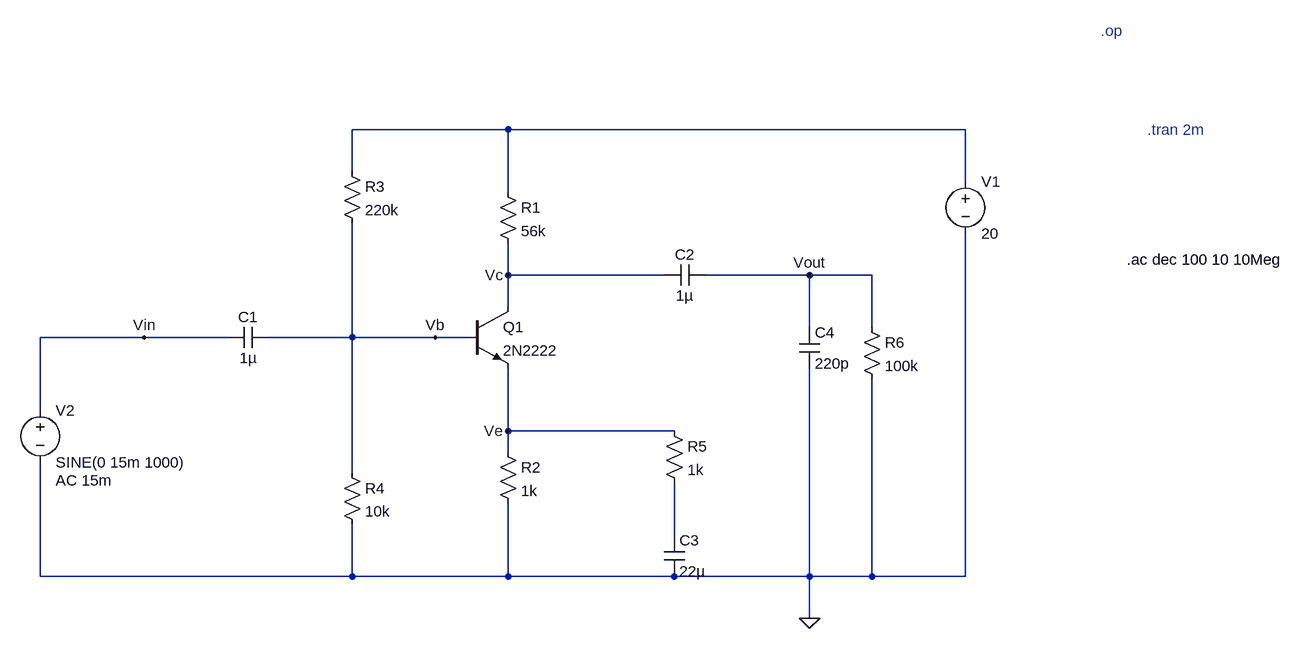
[diagram p0: schematic BJTCE.asc]
BJTCE.asc, the LTspice schematic file:
Version 4.1
SHEET 1 1384 680
WIRE 176 -192 -64 -192
WIRE 880 -192 176 -192
WIRE -64 -128 -64 -192
WIRE 880 -112 880 -192
WIRE 176 -96 176 -192
WIRE 176 32 176 -16
WIRE 416 32 176 32
WIRE 640 32 480 32
WIRE 736 32 640 32
WIRE 176 80 176 32
WIRE 640 112 640 32
WIRE 736 112 736 32
WIRE -384 128 -544 128
WIRE -256 128 -384 128
WIRE -64 128 -64 -48
WIRE -64 128 -192 128
WIRE 64 128 -64 128
WIRE 112 128 64 128
WIRE -544 240 -544 128
WIRE 176 272 176 176
WIRE 432 272 176 272
WIRE 176 304 176 272
WIRE -64 336 -64 128
WIRE 432 432 432 352
WIRE -544 496 -544 320
WIRE -64 496 -64 416
WIRE -64 496 -544 496
WIRE 176 496 176 384
WIRE 176 496 -64 496
WIRE 432 496 176 496
WIRE 640 496 640 176
WIRE 640 496 432 496
WIRE 736 496 736 192
WIRE 736 496 640 496
WIRE 880 496 880 -32
WIRE 880 496 736 496
WIRE 640 560 640 496
FLAG 640 560 0
FLAG 640 32 Vout
FLAG -384 128 Vin
FLAG 64 128 Vb
FLAG 176 32 Vc
FLAG 176 272 Ve
SYMBOL npn 112 80 R0
SYMATTR InstName Q1
SYMATTR Value 2N2222
SYMBOL res 160 -112 R0
SYMATTR InstName R1
SYMATTR Value 56k
SYMBOL res 160 288 R0
SYMATTR InstName R2
SYMATTR Value 1k
SYMBOL res -80 -144 R0
SYMATTR InstName R3
SYMATTR Value 220k
SYMBOL res -80 320 R0
SYMATTR InstName R4
SYMATTR Value 10k
SYMBOL res 416 256 R0
SYMATTR InstName R5
SYMATTR Value 1k
SYMBOL res 720 96 R0
SYMATTR InstName R6
SYMATTR Value 100k
SYMBOL cap -192 112 R90
WINDOW 0 0 32 VBottom 2
WINDOW 3 32 32 VTop 2
SYMATTR InstName C1
SYMATTR Value 1µ
SYMBOL cap 480 16 R90
WINDOW 0 0 32 VBottom 2
WINDOW 3 32 32 VTop 2
SYMATTR InstName C2
SYMATTR Value 1µ
SYMBOL cap 416 432 R0
SYMATTR InstName C3
SYMATTR Value 22µ
SYMBOL cap 624 112 R0
SYMATTR InstName C4
SYMATTR Value 220p
SYMBOL voltage 880 -128 R0
WINDOW 123 0 0 Left 0
WINDOW 39 0 0 Left 0
SYMATTR InstName V1
SYMATTR Value 20
SYMBOL voltage -544 224 R0
WINDOW 123 24 124 Left 2
WINDOW 39 0 0 Left 0
SYMATTR InstName V2
SYMATTR Value SINE(0 15m 1000)
SYMATTR Value2 AC 15m
TEXT 1128 8 Left 2 !.ac dec 100 10 10Meg
TEXT 1160 -192 Left 2 ;.tran 2m
TEXT 1088 -344 Left 2 ;.op

The netlist it stands for:
* BJTCE.asc
Q1 Vc Vb Ve 0 2N2222
R1 N001 Vc 56k
R2 Ve 0 1k
R3 N001 Vb 220k
R4 Vb 0 10k
R5 Ve N002 1k
R6 Vout 0 100k
C1 Vb Vin 1µ
C2 Vout Vc 1µ
C3 N002 0 22µ
C4 Vout 0 220p
V1 N001 0 20
V2 Vin 0 SINE(0 15m 1000) AC 15m
.model NPN NPN
.model PNP PNP
.lib standard.bjt
.ac dec 100 10 10Meg
* .tran 2m
* .op
.backanno
.end